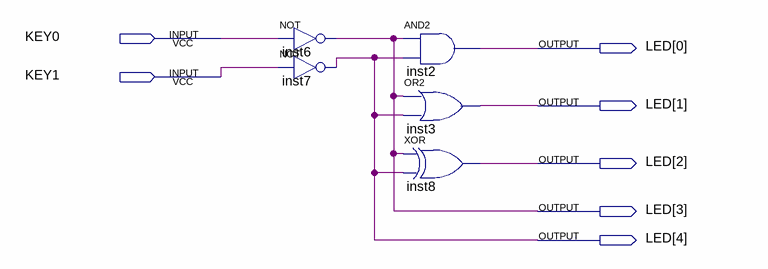
[diagram p0: schematic sheet]
// Quartus schematic submodule.bdf as structural Verilog: 5 symbols, 7 pins
module submodule (
  input  KEY0,
  input  KEY1,
  output [4:0] LED
);

  not inst6 (LED[3], KEY0);
  not inst7 (LED[4], KEY1);
  and inst2 (LED[0], LED[3], LED[4]);
  or inst3 (LED[1], LED[3], LED[4]);
  xor inst8 (LED[2], LED[3], LED[4]);
endmodule
